# Altium schematic sheet PIR_Motion_Sensor.SchDoc: Smart Street Light System - PIR Schematic Doc
size 431 x 279 mm; Author: Arvind Balaji Narayan, Gopik Anand; CompanyName: Cats_and_Dogs; Engineer: Arvind Balaji Narayan, Gopik Anand; Organization: University of Pennsylvania
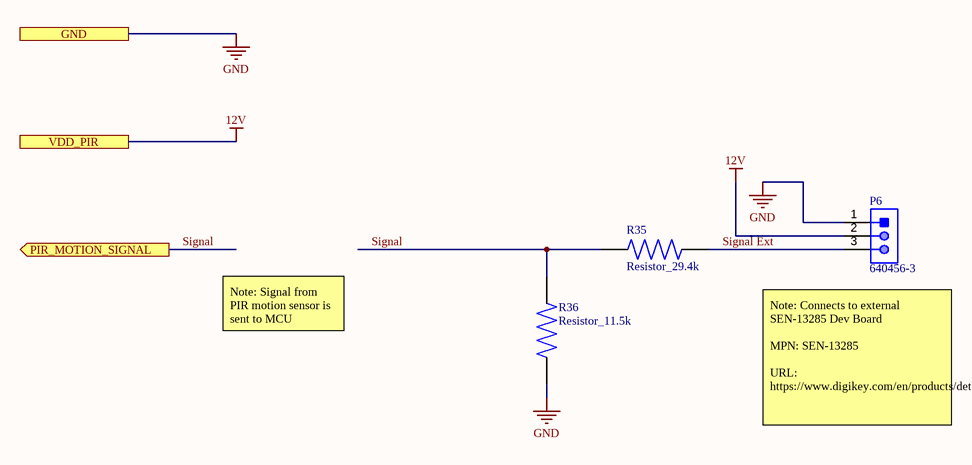
[diagram p0: PIR_Motion_Sensor.SchDoc]

## Parts
P6  640456-3  [TECO-640456-3]
R35  Resistor_29.4k  [Resistor_29.4k]
R36  Resistor_11.5k  [Resistor_11.5k]

## Ports
GND, PIR_MOTION_SIGNAL (out), VDD_PIR

## Nets
12V: P6.2 ; port VDD_PIR
GND: P6.1 R36.1 ; port GND
Signal: R35.1 R36.2 ; port PIR_MOTION_SIGNAL
Signal Ext: P6.3 R35.2

## Notes on the sheet
- Note: Signal from PIR motion sensor is sent to MCU
- (near P6) Note: Connects to external SEN-13285 Dev Board
  MPN: SEN-13285
  URL: https://www.digikey.com/en/products/detail/sparkfun-electronics/SEN-13285/5673793?s=N4IgTCBcDaIM4FMB2BGAzGAHAVhAXQF8g
- DWG. NO.
- REV.
- SHT.
- THIS DOCUMENT AND THE DATA DISCLOSED HEREIN OR HEREWITH IS THE PROPERTY OF ALTIUM LIMITED AND MAY BE FREELY DISTRIBUTED IN WHOLE. NO RIGHTS ARE RESERVED OR EXPRESS OR IMPLIED WARANTEE GIVEN.
- REVISION
- DESCRIPTION
- DATE
- APPROVED
- ENG:
- APPROVALS
- PROJECT
- DSN:
- CHK:
- REFERENCE DOCUMENTS
- PROJECT REVISION:
- TITLE
- DOCUMENT REVISION:
- DESIGN ITEM:
- BOM:
- FAB DWG:
- PCB DWG:
- ASSY DWG:
- SCALE:
- SIZE
- B
- CAGE CODE
- FILE NAME
- DWG NO.
- SHEET
- OF
- REV

## Library data of the parts
P6 = CMP-2000-05418-1: Male Header, Pitch 2.54 mm, 1 x 3 Position, Height 10.03 mm, Tail Length 3.56 mm, -55 to 105 degC; Manufacturer: TE Connectivity; Agency Approvals: CSA,UL; Angle: Straight; Number of Positions: 3; Standards: RoHSCompliant,ELVCompliant,UL94V-0; Current, Rating: 5 / A; Connector Type: MTA-100; Mount Angle: Vertical; Material, Housing: Polyester; Temperature, Operating: -55to+105 / degC; Voltage, Rating: 250 / V; Color, Housing: White; Contact Centerline Spacing: 0.100 / in.; Special Features: Pinstrip; Material, Contact: CopperAlloy; Contact Termination Area Plating: Tin; Primary Type: InterconnectSystem; Pin Spacing: 0.1 / "; Brand/Series: MTA-100Series; Mounting Hole Size: 0.04 / "; Manufacturer URL: http://www.te.com/; Datasheet URL: https://datasheet.ciiva.com/16456/eng-ds-82056-mta-0608-16456886.pdf; Flammability Rating: UL94V-0; Mounting Type: PCMount; Contact Mating Area Plating: Tin; Datasheet Version: Jun-08; Number of Rows: 1; Termination: Solder; Type: PCBPlug; Length, Pin: 0.14 / "; Color: White; Contact Plating: Tin; Contact Shape: Square; Number of Contacts: 3; Size, Post: 0.025 / in.; Length, Terminal Post: 0.14 / in.; Length, Overall: 0.3 / "
R35 = Resistor_29.4k: Res Thick Film 0402 29.4K Ohm 1% 0.063W ±100ppm/°C Molded SMD Paper T/R; Manufacturer: KOA Speer; Manufacturer Part Number: RN73R2ATTD2942F50; Resistance: 29.4kR; Max Power Dissipation: 63mW; Supplier 1: Digi-Key; Supplier Part Number 1: 2019-RN73R2ATTD2942F50CT-ND; RoHS: Yes; Category: Chip SMD Resistors; Pricing 1: 1000=0.06962 (USD); Supplier 2: Digi-Key; Supplier Part Number 2: RMCF0402FT29K4CT-ND; Stock 2: 88848; Pricing 2: 1=0.10000, 10=0.01500, 100=0.00610, 1000=0.00274, 2500=0.00238, 5000=0.00197 (USD); Mount: Surface Mount; Case/Package: 0402; Case Code (Metric): 1005; Case Code (Imperial): 0402; Contact Plating: Tin,Matte; Min Operating Temperature: -55°C; Max Operating Temperature: 155°C; Packaging: Tape and Reel; Tolerance: 1%; Resistor Type: Thick Film; Number of Terminations: 2; Temperature Coefficient: 100ppm/°C; Features: Automotive AEC-Q200; Series: RMCF; Length: 0.039inch; Width: 0.02inch; Height: 0.016inch; Radiation Hardening: No; Lead Free: Lead Free; RoHS Compliant: Yes; ComponentLink1URL: https://www.seielect.com/Catalog/SEI-RMCF_RMCP.pdf?src-supplier=Digi-Key; ComponentLink1Description: https://www.seielect.com/Catalog/SEI-RMCF_RMCP.pdf?src-supplier=Digi-Key; ComponentLink2URL: https://www.seielect.com/catalog/SEI-RMCF_RMCP.pdf?src-supplier=Avnet; ComponentLink2Description: https://www.seielect.com/catalog/SEI-RMCF_RMCP.pdf?src-supplier=Avnet
R36 = Resistor_11.5k: Res 11.5K Ohm 0.5% 1/10W 0603; Manufacturer: KOA Speer; Manufacturer Part Number: RN73R1JTTD1152D100; Supplier 1: Digi-Key; Supplier Part Number 1: 2019-RN73R1JTTD1152D100CT-ND; RoHS: Yes; Category: Chip SMD Resistors; Pricing 1: 1000=0.05712 (USD)